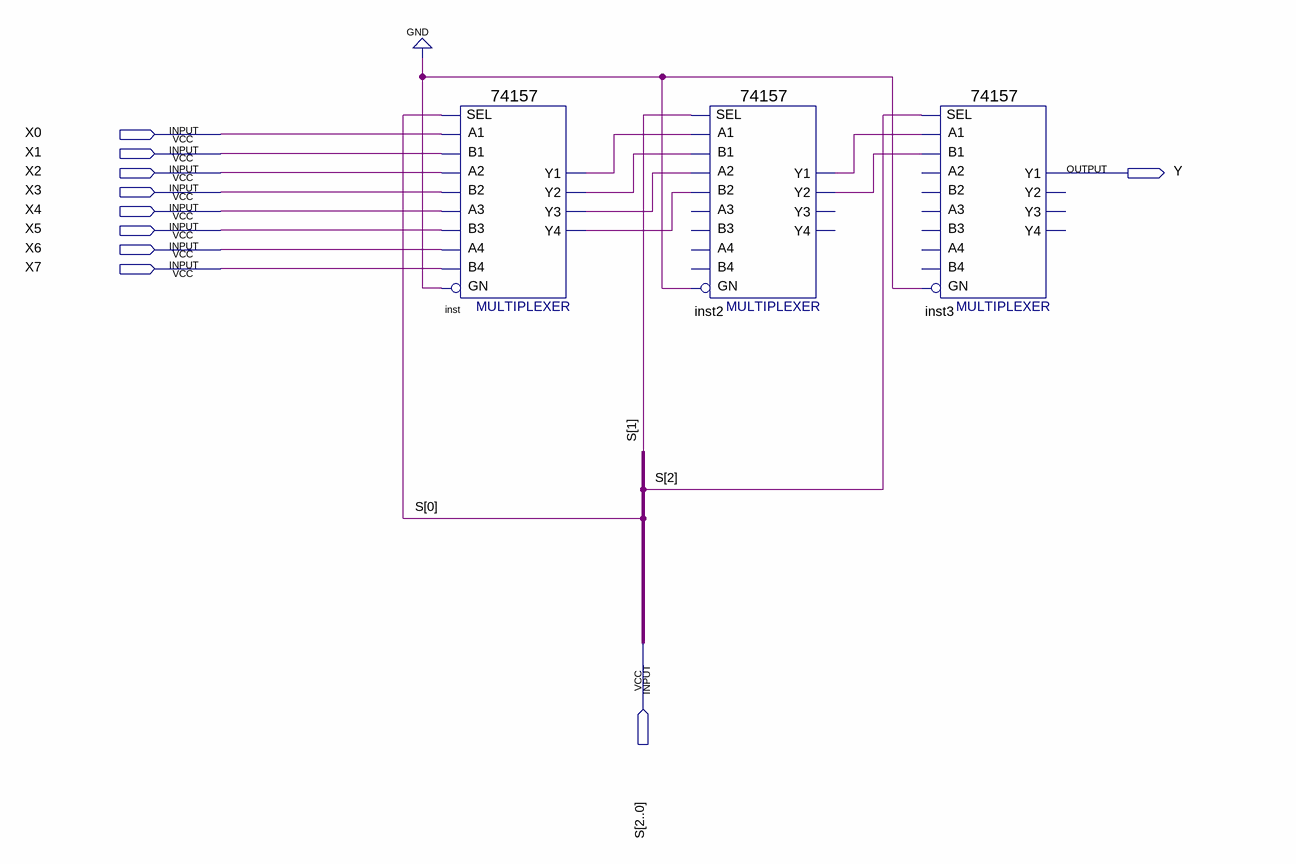
[diagram p0: schematic sheet]
// Quartus schematic Mux8_1.bdf as structural Verilog: 3 symbols, 10 pins
module Mux8_1 (
  input  X0,
  input  X1,
  input  X2,
  input  X3,
  input  X4,
  input  X5,
  input  X6,
  input  X7,
  input  [2:0] S,
  output Y
);

  wire inst2_y1, inst2_y2, inst_y1, inst_y2, inst_y3, inst_y4;

  \74157  inst (
    .A1(X0), .B1(X1), .SEL(S[0]), .B2(X3), .A3(X4), .B3(X5), .A2(X2), .B4(X7), .GN(1'b0), .A4(X6),
    .Y2(inst_y2), .Y1(inst_y1), .Y4(inst_y4), .Y3(inst_y3));
  \74157  inst2 (
    .A1(inst_y1), .B1(inst_y2), .SEL(S[1]), .B2(inst_y4), .A2(inst_y3), .GN(1'b0), .Y2(inst2_y2),
    .Y1(inst2_y1));  // open: A3, B3, B4, A4, Y4, Y3
  \74157  inst3 (
    .A1(inst2_y1), .B1(inst2_y2), .SEL(S[2]), .GN(1'b0), .Y1(Y));  // open: B2, A3, B3, A2, B4, A4, Y2, Y4, Y3
endmodule
